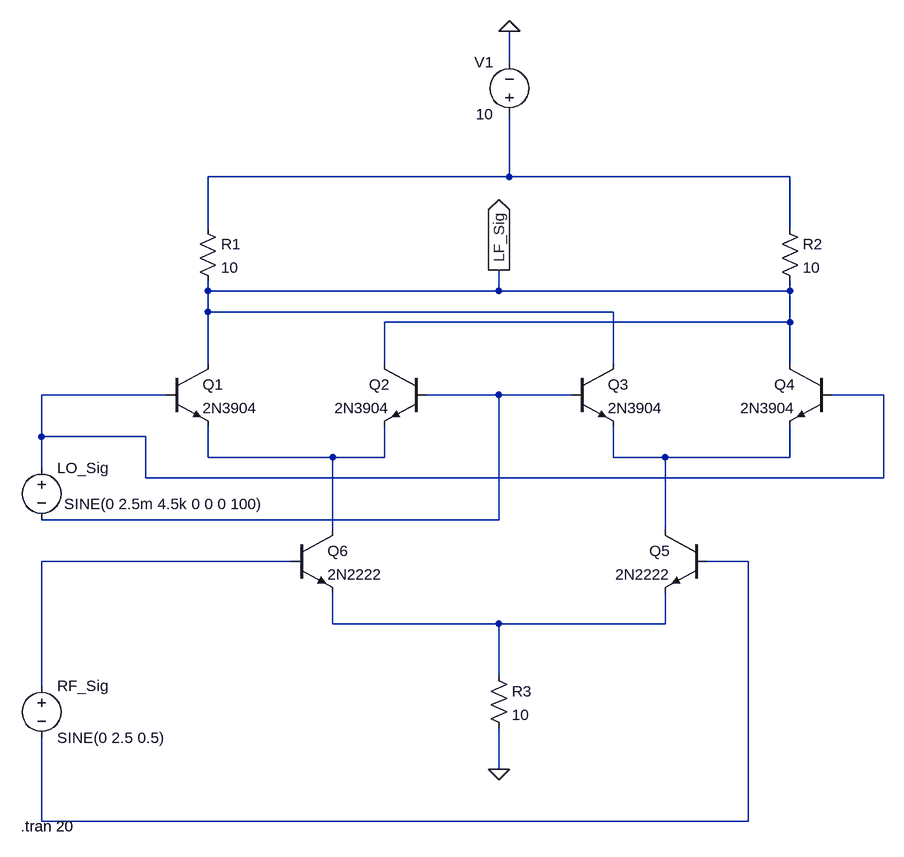
[diagram p0: schematic Double Balanced Gilbert Cell Mixer [TEST].asc]
Double Balanced Gilbert Cell Mixer [TEST].asc, the LTspice schematic file:
Version 4
SHEET 1 1124 808
WIRE 544 -384 544 -432
WIRE 544 -208 544 -304
WIRE 544 -208 80 -208
WIRE 976 -208 544 -208
WIRE 80 -128 80 -208
WIRE 976 -128 976 -208
WIRE 80 -32 80 -48
WIRE 528 -32 528 -64
WIRE 528 -32 80 -32
WIRE 976 -32 976 -48
WIRE 976 -32 528 -32
WIRE 80 0 80 -32
WIRE 704 0 80 0
WIRE 976 16 976 -32
WIRE 976 16 352 16
WIRE 80 80 80 0
WIRE 352 80 352 16
WIRE 704 80 704 0
WIRE 976 80 976 16
WIRE 16 128 -176 128
WIRE 528 128 416 128
WIRE 640 128 528 128
WIRE 1120 128 1040 128
WIRE -176 192 -176 128
WIRE -16 192 -176 192
WIRE 80 224 80 176
WIRE 272 224 80 224
WIRE 352 224 352 176
WIRE 352 224 272 224
WIRE 704 224 704 176
WIRE 784 224 704 224
WIRE 976 224 976 176
WIRE 976 224 784 224
WIRE -176 240 -176 192
WIRE -16 256 -16 192
WIRE 1120 256 1120 128
WIRE 1120 256 -16 256
WIRE 528 320 528 128
WIRE 528 320 -176 320
WIRE 272 336 272 224
WIRE 784 336 784 224
WIRE 208 384 -176 384
WIRE 912 384 848 384
WIRE 272 480 272 432
WIRE 528 480 272 480
WIRE 784 480 784 432
WIRE 784 480 528 480
WIRE 528 560 528 480
WIRE -176 576 -176 384
WIRE 528 704 528 640
WIRE -176 784 -176 656
WIRE 912 784 912 384
WIRE 912 784 -176 784
FLAG 528 704 0
FLAG 544 -432 0
FLAG 528 -64 LF_Sig
IOPIN 528 -64 Out
SYMBOL npn 16 80 R0
SYMATTR InstName Q1
SYMATTR Value 2N3904
SYMBOL npn 416 80 M0
SYMATTR InstName Q2
SYMATTR Value 2N3904
SYMBOL npn 640 80 R0
SYMATTR InstName Q3
SYMATTR Value 2N3904
SYMBOL npn 1040 80 M0
SYMATTR InstName Q4
SYMATTR Value 2N3904
SYMBOL npn 848 336 M0
SYMATTR InstName Q5
SYMATTR Value 2N2222
SYMBOL npn 208 336 R0
SYMATTR InstName Q6
SYMATTR Value 2N2222
SYMBOL res 64 -144 R0
SYMATTR InstName R1
SYMATTR Value 10
SYMBOL res 960 -144 R0
SYMATTR InstName R2
SYMATTR Value 10
SYMBOL res 512 544 R0
SYMATTR InstName R3
SYMATTR Value 10
SYMBOL voltage -176 224 R0
WINDOW 3 35 72 Left 2
WINDOW 123 0 0 Left 0
WINDOW 39 0 0 Left 0
SYMATTR InstName LO_Sig
SYMATTR Value SINE(0 2.5m 4.5k 0 0 0 100)
SYMBOL voltage -176 560 R0
WINDOW 123 24 124 Left 2
WINDOW 39 0 0 Left 0
SYMATTR InstName RF_Sig
SYMATTR Value SINE(0 2.5 0.5)
SYMBOL voltage 544 -288 R180
WINDOW 0 24 96 Left 2
WINDOW 3 24 16 Left 2
WINDOW 123 0 0 Left 0
WINDOW 39 0 0 Left 0
SYMATTR InstName V1
SYMATTR Value 10
TEXT -208 792 Left 2 !.tran 20

The netlist it stands for:
* Double Balanced Gilbert Cell Mixer [TEST].asc
Q1 LF_Sig N002 N004 0 2N3904
Q2 LF_Sig N003 N004 0 2N3904
Q3 LF_Sig N003 N005 0 2N3904
Q4 LF_Sig N002 N005 0 2N3904
Q5 N005 N007 N008 0 2N2222
Q6 N004 N006 N008 0 2N2222
R1 N001 LF_Sig 10
R2 N001 LF_Sig 10
R3 N008 0 10
V§LO_Sig N002 N003 SINE(0 2.5m 4.5k 0 0 0 100)
V§RF_Sig N006 N007 SINE(0 2.5 0.5)
V1 N001 0 10
.model NPN NPN
.model PNP PNP
.lib standard.bjt
.tran 20
.backanno
.end